# Altium schematic sheet PDMC-S05-V00-Multiplexer.SchDoc: Sense Multiplexing
size A3; DrawnBy: Zoe Goodward; Organization: QUT Motorsport; Address1: O-120, Gardens Point; Address2: 2 George Street; Address3: Brisbane, QLD 4000; Address4: Australia; DocumentNumber: 5; Revision: 01; SheetNumber: 5; SheetTotal: 6; Version: 01; Project: Power Distribution Module Card; PageSetup: Record=PageOptions|CenterHorizontal=True|CenterVertical=True|PrintScale=0.97|XCorrection=1.00|YCorrection=1.00|PrintKind=0|BorderSize=5000000|LeftOffset=0|BottomOffset=0|Orientation=2|PaperLength=1000|PaperWidth=1000|Scale=100|PaperSource=7|PrintQuality=-4|MediaType=1|DitherType=10|PaperKind=A4|PrintScaleMode=1
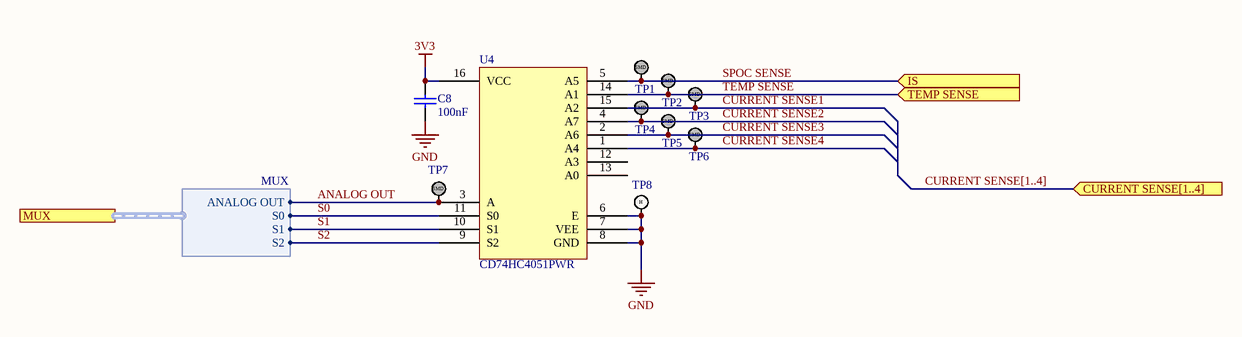
[diagram p0: PDMC-S05-V00-Multiplexer.SchDoc]

## Parts
C8  100nF  [Cap_Ceramic_0603]
TP1  TestPoint_SMD  [TestPointSMD]  (value not drawn)
TP2  TestPoint_SMD  [TestPointSMD]  (value not drawn)
TP3  TestPoint_SMD  [TestPointSMD]  (value not drawn)
TP4  TestPoint_SMD  [TestPointSMD]  (value not drawn)
TP5  TestPoint_SMD  [TestPointSMD]  (value not drawn)
TP6  TestPoint_SMD  [TestPointSMD]  (value not drawn)
TP7  TestPoint_SMD  [TestPointSMD]  (value not drawn)
TP8  TestPoint_Hoop_White  [TestPointHoop_WHITE]  (value not drawn)
U4  CD74HC4051PWR  [TSSOP-16N]

## Ports
CURRENT SENSE[1..4] (in), IS (in), MUX (harness MUX), TEMP SENSE (in)

## Harnesses
MUX: ANALOG OUT, S0, S1, S2

## Nets
3V3: C8.2 U4.16(VCC)
GND: C8.1 TP8.1 U4.6(E) U4.7(VEE) U4.8(GND)
ANALOG OUT: TP7.1 U4.3(A) ; port MUX.ANALOG OUT
CURRENT SENSE1: TP3.1 U4.15(A2)
CURRENT SENSE2: TP4.1 U4.4(A7)
CURRENT SENSE3: TP5.1 U4.2(A6)
CURRENT SENSE4: TP6.1 U4.1(A4)
S0: U4.11(S0) ; port MUX.S0
S1: U4.10(S1) ; port MUX.S1
S2: U4.9(S2) ; port MUX.S2
SPOC SENSE: TP1.1 U4.5(A5) ; port IS
TEMP SENSE: TP2.1 U4.14(A1) ; port TEMP SENSE

Not connected (* = marked no-connect by the designer): U4 12(A3) 13(A0)

## Buses and harness runs
bus CURRENT SENSE[1..4] = port CURRENT SENSE[1..4]

## Notes on the sheet
- Revision History:
- Sheet Title:
- Rev
- Date
- Description
- Project:
- Size:
- Drawn By:
- A3
- Number:
- Revision:
- Sheet
- Version:
- of
- QUT Motorsport
- O-120, Gardens Point
- 2 George Street
- Brisbane, QLD 4000
- Australia
- Print Date:
- Print Time:
- File Name:
- (in symbol TestPoint_Hoop_White) H
- (in symbol TestPoint_SMD) SMD

## Library data of the parts
C8 = 100nF 50V 5% X7R 0603: Capacitor, Ceramic, SMD, 100nF, 50V, 5%, X7R, 0603
U4 = CD74HC4051PWR: IC MUX/DEMUX 8X1 16TSSOP; ComponentLink1Description: Datasheet; ComponentLink1URL: https://www.ti.com/lit/ds/symlink/cd74hc4051.pdf?HQS=TI-null-null-digikeymode-df-pf-null-wwe&ts=1595658940184; ComponentLink2Description: Digikey; ComponentLink2URL: https://www.digikey.com/product-detail/en/texas-instruments/CD74HC4051PWR/296-13031-1-ND/480146